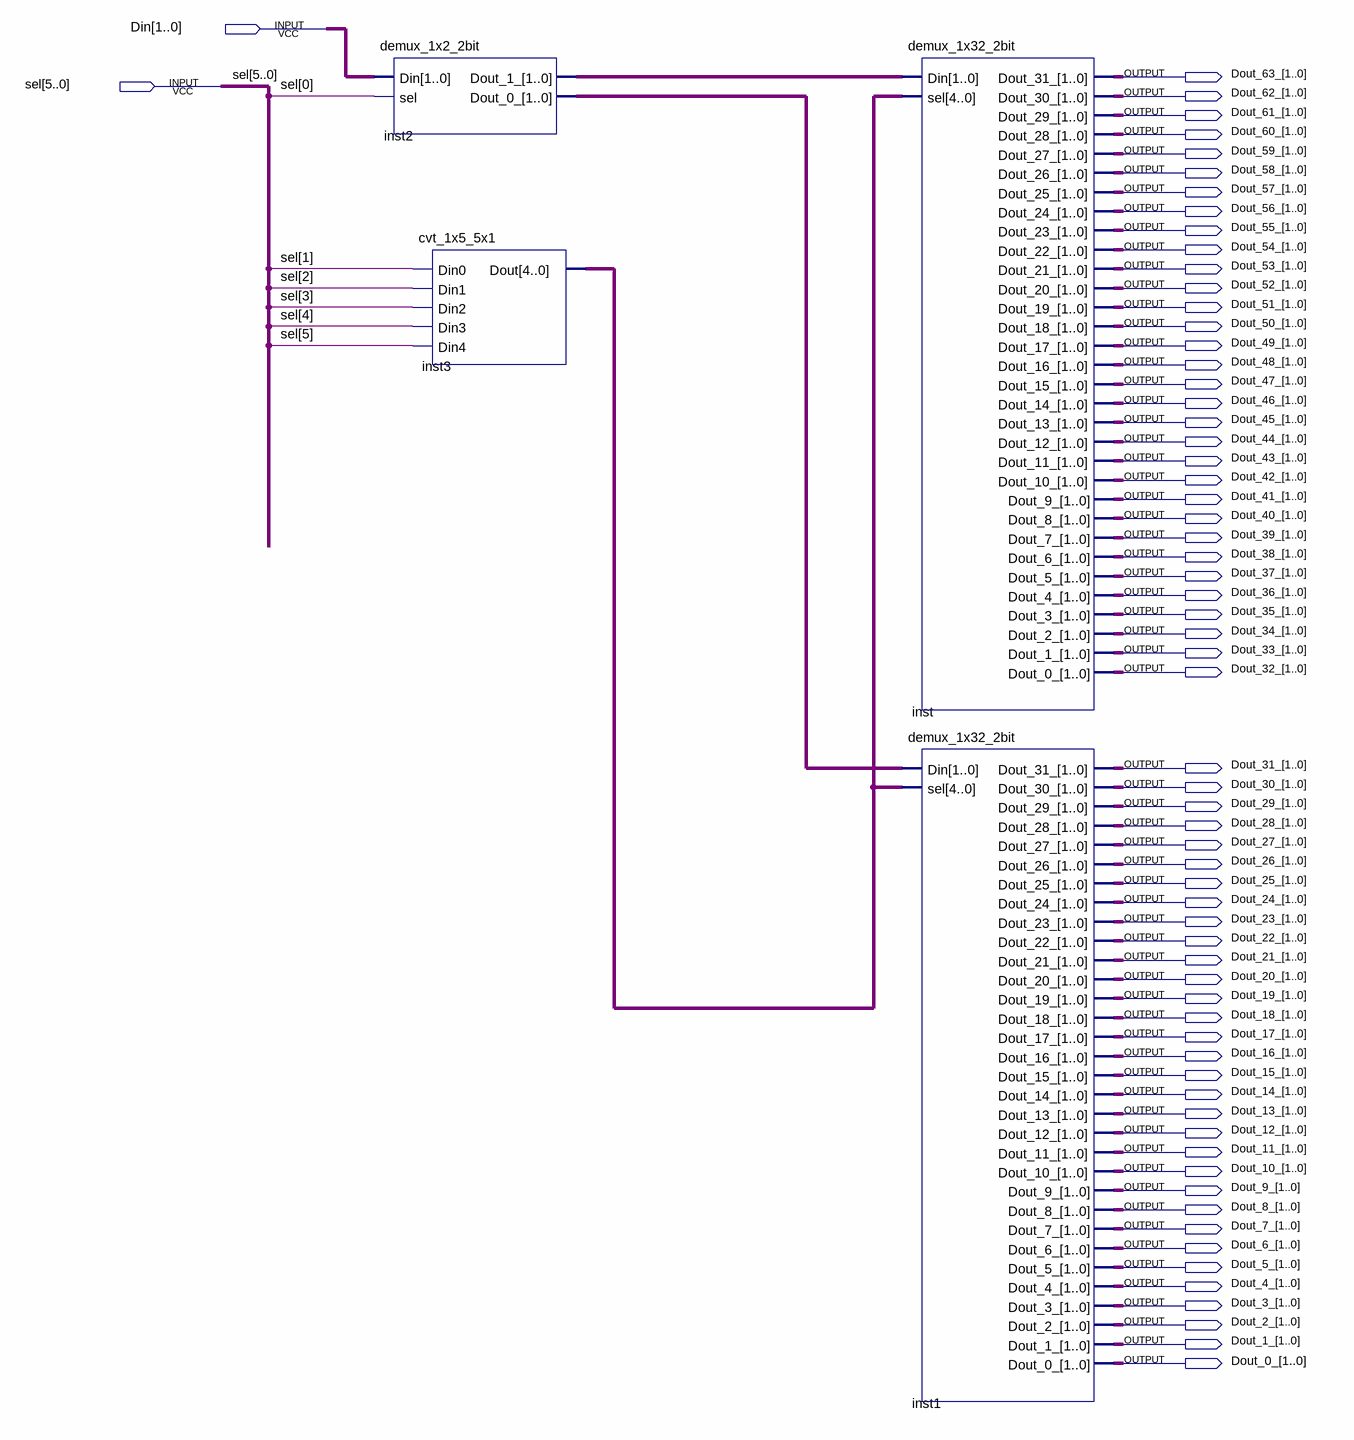
[diagram p0: schematic sheet]
// Quartus schematic demux_1x64_2bit.bdf as structural Verilog: 4 symbols, 66 pins
module demux_1x64_2bit (
  input  [1:0] Din,
  input  [5:0] sel,
  output [1:0] Dout_63_,
  output [1:0] Dout_62_,
  output [1:0] Dout_61_,
  output [1:0] Dout_60_,
  output [1:0] Dout_59_,
  output [1:0] Dout_58_,
  output [1:0] Dout_57_,
  output [1:0] Dout_56_,
  output [1:0] Dout_55_,
  output [1:0] Dout_54_,
  output [1:0] Dout_53_,
  output [1:0] Dout_52_,
  output [1:0] Dout_51_,
  output [1:0] Dout_50_,
  output [1:0] Dout_49_,
  output [1:0] Dout_48_,
  output [1:0] Dout_47_,
  output [1:0] Dout_46_,
  output [1:0] Dout_45_,
  output [1:0] Dout_44_,
  output [1:0] Dout_43_,
  output [1:0] Dout_42_,
  output [1:0] Dout_41_,
  output [1:0] Dout_40_,
  output [1:0] Dout_39_,
  output [1:0] Dout_38_,
  output [1:0] Dout_37_,
  output [1:0] Dout_36_,
  output [1:0] Dout_35_,
  output [1:0] Dout_34_,
  output [1:0] Dout_33_,
  output [1:0] Dout_32_,
  output [1:0] Dout_31_,
  output [1:0] Dout_30_,
  output [1:0] Dout_29_,
  output [1:0] Dout_28_,
  output [1:0] Dout_27_,
  output [1:0] Dout_26_,
  output [1:0] Dout_25_,
  output [1:0] Dout_24_,
  output [1:0] Dout_23_,
  output [1:0] Dout_22_,
  output [1:0] Dout_21_,
  output [1:0] Dout_20_,
  output [1:0] Dout_19_,
  output [1:0] Dout_18_,
  output [1:0] Dout_17_,
  output [1:0] Dout_16_,
  output [1:0] Dout_15_,
  output [1:0] Dout_14_,
  output [1:0] Dout_13_,
  output [1:0] Dout_12_,
  output [1:0] Dout_11_,
  output [1:0] Dout_10_,
  output [1:0] Dout_9_,
  output [1:0] Dout_8_,
  output [1:0] Dout_7_,
  output [1:0] Dout_6_,
  output [1:0] Dout_5_,
  output [1:0] Dout_4_,
  output [1:0] Dout_3_,
  output [1:0] Dout_2_,
  output [1:0] Dout_1_,
  output [1:0] Dout_0_
);

  wire [1:0] inst2_dout_0_, inst2_dout_1_;
  wire [4:0] inst3_dout;

  demux_1x2_2bit inst2 (.Din(Din), .sel(sel[0]), .Dout_1_(inst2_dout_1_), .Dout_0_(inst2_dout_0_));
  cvt_1x5_5x1 inst3 (.Din0(sel[1]), .Din1(sel[2]), .Din2(sel[3]), .Din3(sel[4]), .Din4(sel[5]), .Dout(inst3_dout));
  demux_1x32_2bit inst (
    .Din(inst2_dout_1_), .sel(inst3_dout), .Dout_31_(Dout_63_), .Dout_30_(Dout_62_), .Dout_29_(Dout_61_),
    .Dout_28_(Dout_60_), .Dout_27_(Dout_59_), .Dout_26_(Dout_58_), .Dout_25_(Dout_57_), .Dout_24_(Dout_56_),
    .Dout_23_(Dout_55_), .Dout_22_(Dout_54_), .Dout_21_(Dout_53_), .Dout_20_(Dout_52_), .Dout_19_(Dout_51_),
    .Dout_18_(Dout_50_), .Dout_17_(Dout_49_), .Dout_16_(Dout_48_), .Dout_15_(Dout_47_), .Dout_14_(Dout_46_),
    .Dout_13_(Dout_45_), .Dout_12_(Dout_44_), .Dout_11_(Dout_43_), .Dout_10_(Dout_42_), .Dout_9_(Dout_41_),
    .Dout_8_(Dout_40_), .Dout_7_(Dout_39_), .Dout_6_(Dout_38_), .Dout_5_(Dout_37_), .Dout_4_(Dout_36_),
    .Dout_3_(Dout_35_), .Dout_2_(Dout_34_), .Dout_1_(Dout_33_), .Dout_0_(Dout_32_));
  demux_1x32_2bit inst1 (
    .Din(inst2_dout_0_), .sel(inst3_dout), .Dout_31_(Dout_31_), .Dout_30_(Dout_30_), .Dout_29_(Dout_29_),
    .Dout_28_(Dout_28_), .Dout_27_(Dout_27_), .Dout_26_(Dout_26_), .Dout_25_(Dout_25_), .Dout_24_(Dout_24_),
    .Dout_23_(Dout_23_), .Dout_22_(Dout_22_), .Dout_21_(Dout_21_), .Dout_20_(Dout_20_), .Dout_19_(Dout_19_),
    .Dout_18_(Dout_18_), .Dout_17_(Dout_17_), .Dout_16_(Dout_16_), .Dout_15_(Dout_15_), .Dout_14_(Dout_14_),
    .Dout_13_(Dout_13_), .Dout_12_(Dout_12_), .Dout_11_(Dout_11_), .Dout_10_(Dout_10_), .Dout_9_(Dout_9_),
    .Dout_8_(Dout_8_), .Dout_7_(Dout_7_), .Dout_6_(Dout_6_), .Dout_5_(Dout_5_), .Dout_4_(Dout_4_),
    .Dout_3_(Dout_3_), .Dout_2_(Dout_2_), .Dout_1_(Dout_1_), .Dout_0_(Dout_0_));
endmodule
